# Altium schematic sheet MCU.SchDoc
size A3; SheetNumber: 2; SheetTotal: 3
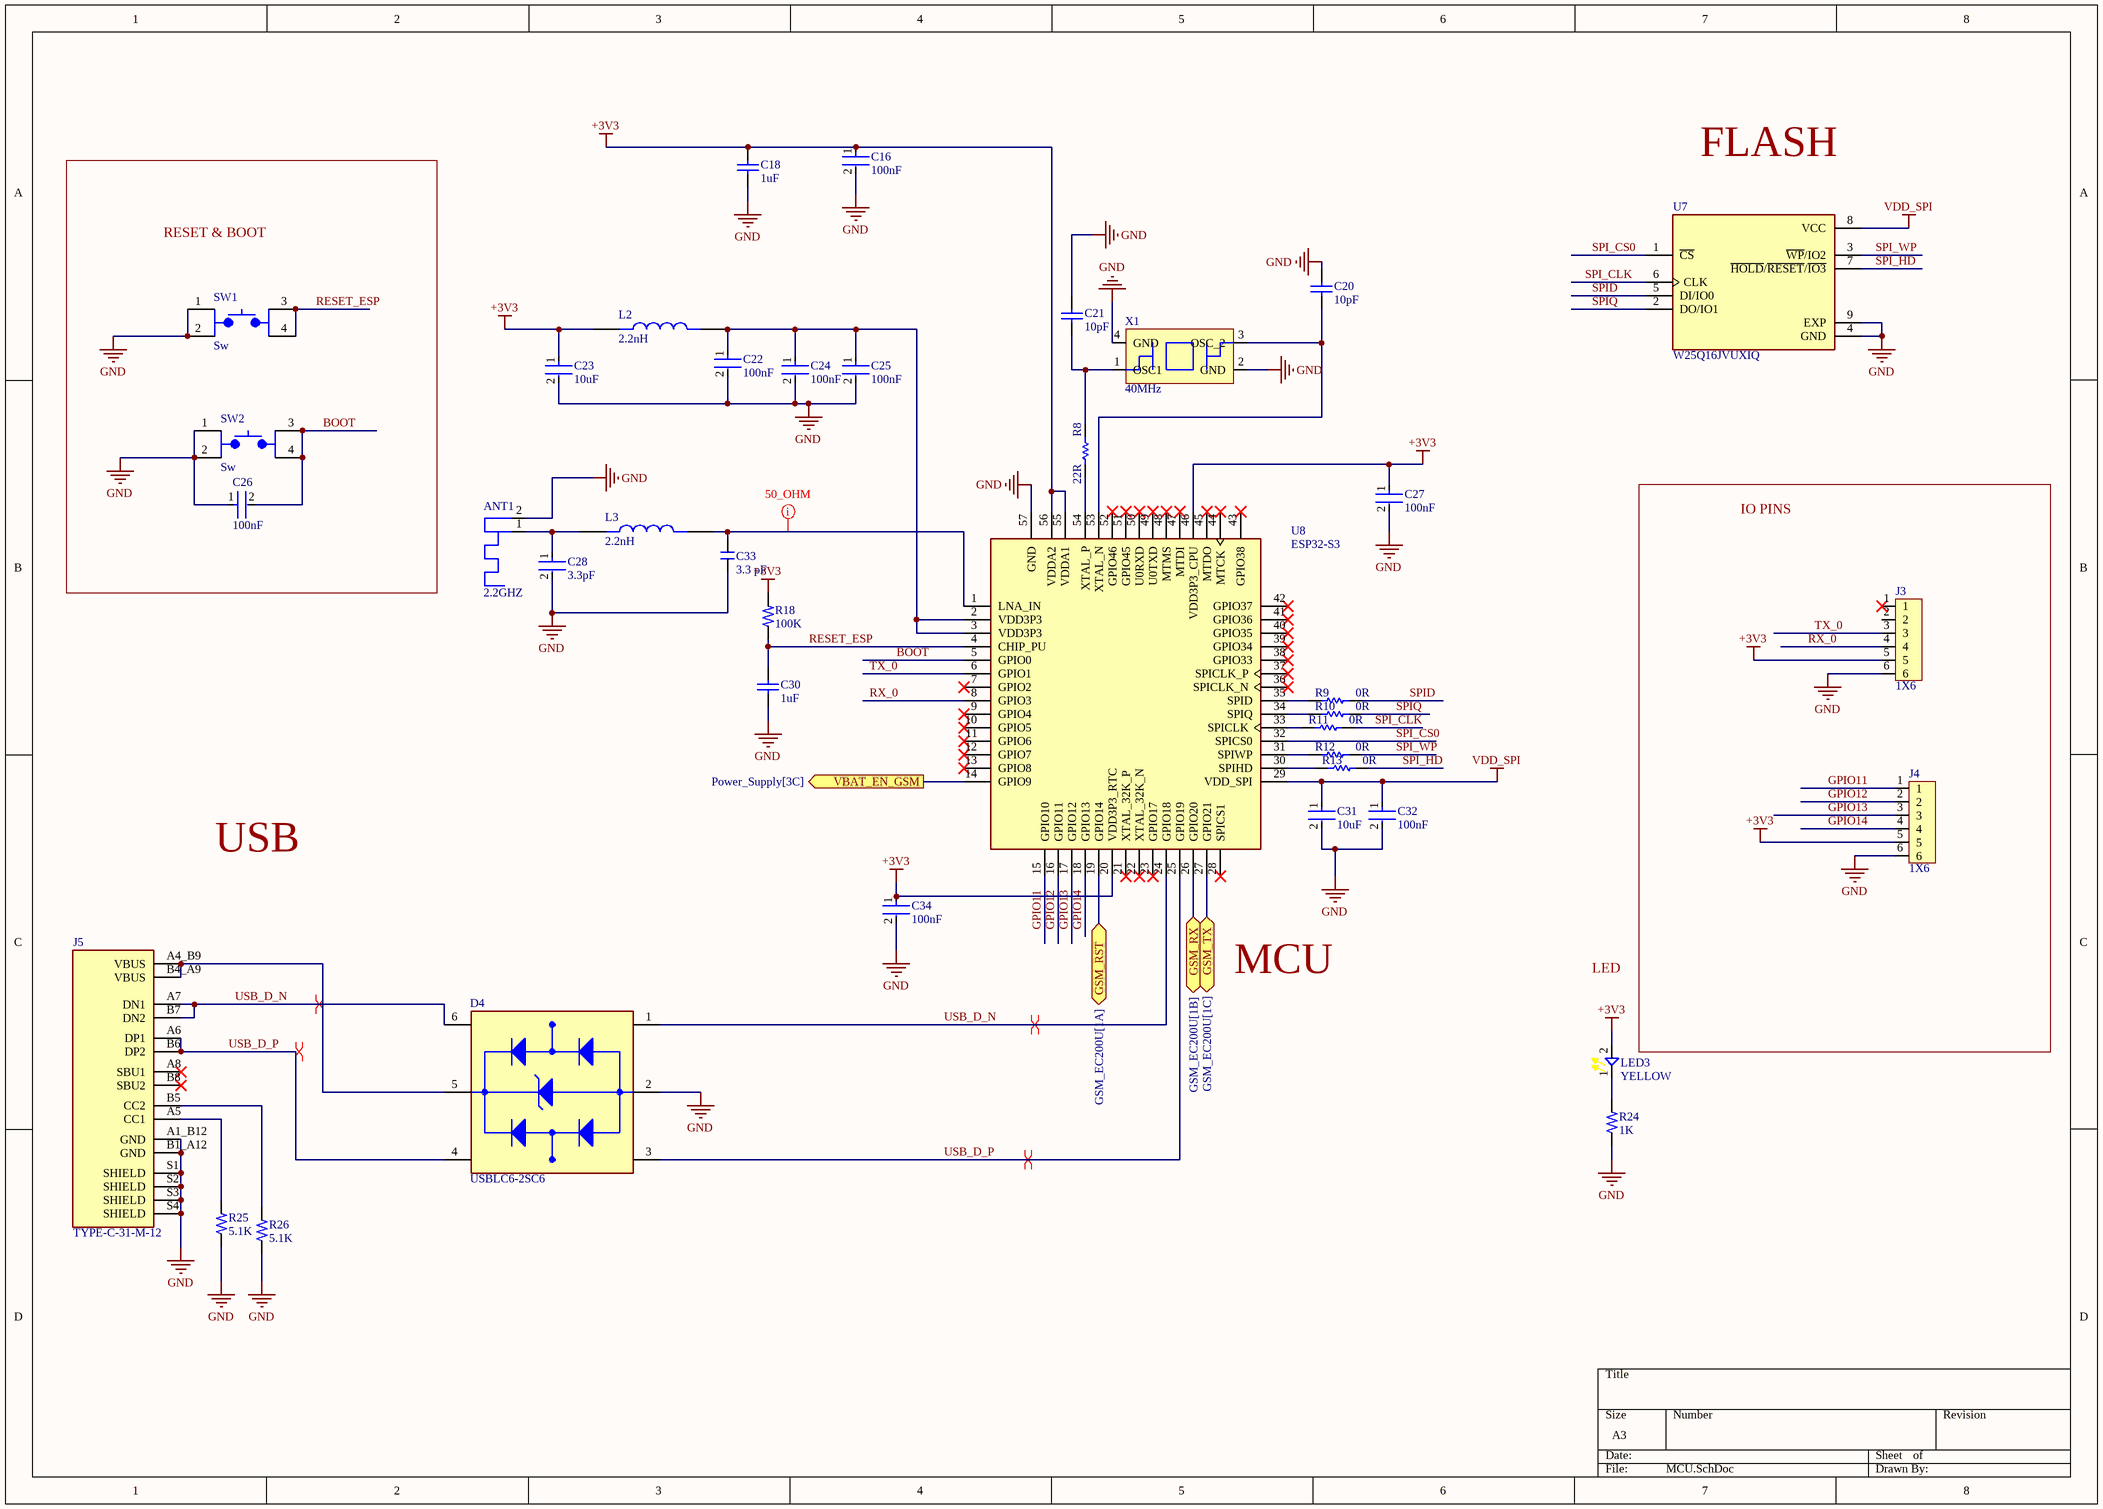
[diagram p0: MCU.SchDoc]

## Parts
ANT1  2.2GHZ  [2.4 GHz PCB antenna]
C16  100nF  [FP-CGA3E-0_3-0_1-IPC_A]
C18  1uF  [CAPC1608X90X35LL15T15]
C20  10pF  [CAPC1608X90X35LL10T15]
C21  10pF  [CAPC1608X90X35LL10T15]
C22  100nF  [FP-CGA3E-0_3-0_1-IPC_A]
C23  10uF  [FP-GRM188-0_1-e0_2_0_55-IPC_A]
C24  100nF  [FP-CGA3E-0_3-0_1-IPC_A]
C25  100nF  [FP-CGA3E-0_3-0_1-IPC_A]
C26  100nF  [FP-CGA3E-0_3-0_1-IPC_A]
C27  100nF  [FP-CGA3E-0_3-0_1-IPC_A]
C28  3.3pF  [FP-C0603C-CF-MFG]
C30  1uF  [CAPC1608X90X35LL15T15]
C31  10uF  [FP-GRM188-0_1-e0_2_0_55-IPC_A]
C32  100nF  [FP-CGA3E-0_3-0_1-IPC_A]
C33  3.3 pF  [Capacitor_0805]
C34  100nF  [FP-CGA3E-0_3-0_1-IPC_A]
D4  USBLC6-2SC6  [SOT-23-6]
J3  1X6  [Header_1X6_2.54mm]
J4  1X6  [Header_1X6_2.54mm]
J5  TYPE-C-31-M-12  [TYPE-C-31-M-12]
L2  2.2nH  [Inductor_0603]
L3  2.2nH  [Inductor_0603]
LED3  YELLOW  [LED_YELLOW_0603]
R8  22R  [RESC1608X55X25NL10T15]
R9  0R  [RESC1609X50X30NL8T20]
R10  0R  [RESC1609X50X30NL8T20]
R11  0R  [RESC1609X50X30NL8T20]
R12  0R  [RESC1609X50X30NL8T20]
R13  0R  [RESC1609X50X30NL8T20]
R18  100K  [Resistor_0603]
R24  1K  [Resistor_0805]
R25  5.1K  [Resistor_0805]
R26  5.1K  [Resistor_0805]
SW1  Sw  [SW_Tactile_SMD]
SW2  Sw  [SW_Tactile_SMD]
U7  W25Q16JVUXIQ  [8_USON]
U8  ESP32-S3  [ESP32S3]
X1  40MHz  [SMD2520-4P]

## Blocks framed on the sheet
RESET & BOOT: C26 SW1 SW2
IO PINS: J3 J4

## Ports
GSM_RST (bidir, see GSM_EC200U[1A]), GSM_RX (bidir, see GSM_EC200U[1B]), GSM_TX (bidir, see GSM_EC200U[1C]), VBAT_EN_GSM (out, see Power_Supply[3C])

## Nets
+3V3: C16.1 C18.2 C23.1 C27.1 C34.1 J3.5 J4.5 L2.1 LED3.2 R18.2 U8.20(VDD3P3_RTC) U8.46(VDD3P3_CPU) U8.55(VDDA1) U8.56(VDDA2)
GND: ANT1.2 C16.2 C18.1 C20.2 C21.2 C22.2 C23.2 C24.2 C25.2 C26.1 C27.2 C28.2 C30.1 C31.2 C32.2 C33.1 C34.2 D4.2(GND) J3.6 J4.6 J5.A1_B12(GND) J5.B1_A12(GND) J5.S1(SHIELD) J5.S2(SHIELD) J5.S3(SHIELD) J5.S4(SHIELD) R24.1 R25.1 R26.1 SW1.1 SW1.2 SW2.1 SW2.2 U7.4(GND) U7.9(EXP) U8.57(GND) X1.2(GND) X1.4(GND)
VDD_SPI: C31.1 C32.1 U7.8(VCC) U8.29(VDD_SPI)
BOOT: C26.2 SW2.3 SW2.4 U8.5(GPIO0)
GPIO11: J4.1 U8.15(GPIO10)
GPIO12: J4.2 U8.16(GPIO11)
GPIO13: J4.3 U8.17(GPIO12)
GPIO14: J4.4 U8.18(GPIO13)
GSM_RST: U8.19(GPIO14) ; port GSM_RST
GSM_RX: U8.26(GPIO20) ; port GSM_RX
GSM_TX: U8.27(GPIO21) ; port GSM_TX
RESET_ESP: C30.2 R18.1 SW1.3 SW1.4 U8.4(CHIP_PU)
RX_0: J3.4 U8.8(GPIO3)
SPI_CLK: R11.2 U7.6(CLK)
SPI_CS0: U7.1(~{CS}) U8.32(SPICS0)
SPI_HD: R13.2 U7.7(~{HOLD}/~{RESET}/~{IO3})
SPI_WP: R12.2 U7.3(~{WP}/IO2)
SPID: R9.2 U7.5(DI/IO0)
SPIQ: R10.2 U7.2(DO/IO1)
TX_0: J3.3 U8.6(GPIO1)
USB_D_N: D4.1(I/O1_IN) D4.6(I/O1_OUT) J5.A7(DN1) J5.B7(DN2) U8.24(GPIO18)
USB_D_P: D4.3(I/O2_IN) D4.4(I/O2_OUT) J5.A6(DP1) J5.B6(DP2) U8.25(GPIO19)
VBAT_EN_GSM: U8.14(GPIO9) ; port VBAT_EN_GSM
NetANT1_1: ANT1.1 C28.1 L3.1
NetC20_1: C20.1 U8.53(XTAL_N) X1.3(OSC_2)
NetC21_1: C21.1 R8.2 X1.1(OSC1)
NetC22_1: C22.1 C24.1 C25.1 L2.2 U8.2(VDD3P3) U8.3(VDD3P3)
NetC33_2: C33.2 L3.2 U8.1(LNA_IN)
NetD4_5: D4.5(VBUS) J5.A4_B9(VBUS) J5.B4_A9(VBUS)
NetJ5_A5: J5.A5(CC1) R25.2
NetJ5_B5: J5.B5(CC2) R26.2
NetLED3_1: LED3.1 R24.2
NetR8_1: R8.1 U8.54(XTAL_P)
NetR9_1: R9.1 U8.35(SPID)
NetR10_1: R10.1 U8.34(SPIQ)
NetR11_1: R11.1 U8.33(SPICLK)
NetR12_1: R12.1 U8.31(SPIWP)
NetR13_1: R13.1 U8.30(SPIHD)

Not connected (* = marked no-connect by the designer): J3 1* 2; J5 A8(SBU1)* B8(SBU2)*; U8 7(GPIO2)* 9(GPIO4)* 10(GPIO5)* 11(GPIO6)* 12(GPIO7)* 13(GPIO8)* 21(XTAL_32K_P)* 22(XTAL_32K_N)* 23(GPIO17)* 28(SPICS1)* 36(SPICLK_N)* 37(SPICLK_P)* 38(GPIO33)* 39(GPIO34)* 40(GPIO35)* 41(GPIO36)* 42(GPIO37)* 43(GPIO38)* 44(MTCK)* 45(MTDO)* 47(MTDI)* 48(MTMS)* 49(U0TXD)* 50(U0RXD)* 51(GPIO45)* 52(GPIO46)*

## Layout directives
differential pair; net class 90_OHM: USB_D_N, USB_D_P
net class 50_OHM: NetC33_2

## Notes on the sheet
- FLASH
- USB
- MCU
- LED

## Library data of the parts
ANT1 = 2.4 GHz PCB antenna
C16 C22 C24-C27 C32 C34 = CMP-2000-07546-2: Cap Ceramic 100nF 50V X7R 10% Pad SMD 0603 +125°C Automotive T/R; Weight: 7.1E-05oz; Composition: Ceramic; Max Operating Temperature: 125°C; Termination: SMD/SMT; Dielectric: X7R; Length: 1.6mm; Package Quantity: 1; REACH SVHC: No SVHC; Lead Free: Lead Free; Case Code (Metric): 1608; Min Operating Temperature: -55°C; Packaging: Tape and Reel; Tolerance: 10%; Voltage Rating: 50V; Case Code (Imperial): 0603; Capacitance: 100nF; Case/Package: 0603; Voltage Rating (DC): 50V; Depth: 0.8mm; Radiation Hardening: No; Ratings: AEC-Q200; Mount: Surface Mount; Voltage: 50V; Thickness: 0.035inch; Width: 0.8mm; Height: 0.8mm
C18 C30 = CMP-2006-02298-2: Manufacturer: Kemet; Part Number: C0603C105K4RACTU
C20 C21 = CMP-2006-02592-1: Part Number: GRM1885C1H100JA01D; Manufacturer: Murata
C23 C31 = CMP-2006-02792-2: Chip Multilayer Ceramic Capacitors for General Purpose, 0603, 10uF, X5R, 15%, 20%, 6.3V; Packaging: Tape and Reel; Voltage Rating (DC): 6.3V; Width: 0.031inch; Termination: SMD/SMT; Dielectric: X5R; Package Quantity: 4000; Voltage Rating: 6.3V; Capacitance: 10uF; Case/Package: 0603; Min Operating Temperature: -55°C; Voltage: 6.3V; Length: 1.6mm; Thickness: 0.035inch; Lead Free: Lead Free; Depth: 0.8mm; Case Code (Imperial): 0603; Max Operating Temperature: 85°C; Material: Ceramic; Height: 0.8mm; Tolerance: 20%; Mount: Surface Mount; REACH SVHC: No SVHC; Radiation Hardening: No; Case Code (Metric): 1608
C28 = CMP-1035-00238-3: CAP CER 3.3PF 50V NP0 0603; Manufacturer Part Number: C0603C339C5GACTU; Manufacturer: KEMET; Tolerance: 0.25 pF; Material: Ceramic; Temperature Characteristic: C0G; Automotive Grade: Grade 1; Temperature Coefficient: 30ppm/°C; Height: 0.87mm; Category: Cap; Automotive: Yes; Voltage Rating: 50 V; Capacitance: 3.3 pF; ComponentLink2Description: Datasheet; Octopart: https://octopart.com/c0603c339c5gactu-kemet-3701205; Temperature Range Low: -55°C; Device Class L3: Ceramic Capacitors; Package: C0603C-CF; Temperature: -55°C to +125°C; Digikey Description: CAP CER 3.3PF 50V NP0 0603; Temperature Range High: +125°C; ComponentLink2URL: https://api.kemet.com/component-edge/download/datasheet/C0603C100J5GACAUTO.pdf; Device Class L1: Passive Components; Value: 3.3 pF; RoHS: TRUE; Lead Free: Yes; Mouser Description: Multilayer Ceramic Capacitors MLCC - SMD/SMT 50volts 3.3pF C0G 0.25%; Device Class L2: Capacitors
C33 = CAP 3.3 pF 0805: Multilayer Ceramic Capacitor, 3.3 pF, 50 V, ± 0.1pF, C0G (NP0), 0805 [2012 Metric]; Manufacturer: Yageo; Manufacturer Part Number: CC0805BRNPO9BN3R3; Supplier: Digikey; Supplier Part Number: 311-4130-1-ND; RoHS: Yes; Category: Ceramic Capacitors; Stock: 19725; Pricing: 1=0,13, 10=0,075, 100=0,0453, 1000=0,03028 (USD); Halogen Free: 5694HalogenFree; ComponentLink1URL: http://www.mouser.com/ds/2/447/Yageo_UPY-GP_NP0_16V-to-50V_9-358835.pdf?src-supplier=Mouser; ComponentLink1Description: http://www.mouser.com/ds/2/447/Yageo_UPY-GP_NP0_16V-to-50V_9-358835.pdf?src-supplier=Mouser; ComponentLink2URL: https://datasheet.octopart.com/CC0805BRNPO9BN3R3-Yageo-datasheet-151948684.pdf?src-supplier=Newark; ComponentLink2Description: https://datasheet.octopart.com/CC0805BRNPO9BN3R3-Yageo-datasheet-151948684.pdf?src-supplier=Newark; ComponentLink3URL: https://datasheet.octopart.com/CC0805BRNPO9BN3R3-Yageo-datasheet-151948684.pdf?src-supplier=Farnell; ComponentLink3Description: https://datasheet.octopart.com/CC0805BRNPO9BN3R3-Yageo-datasheet-151948684.pdf?src-supplier=Farnell; ComponentLink4URL: http://www.yageo.com/documents/recent/UPY-GP_NP0_16V-to-50V_8.pdf?src-supplier=Avnet; ComponentLink4Description: http://www.yageo.com/documents/recent/UPY-GP_NP0_16V-to-50V_8.pdf?src-supplier=Avnet; ComponentLink5URL: https://www.yageo.com/upload/media/product/productsearch/datasheet/mlcc/UPY-GP_NP0_16V-to-50V_18.pdf?src-supplier=Digikey; ComponentLink5Description: https://www.yageo.com/upload/media/product/productsearch/datasheet/mlcc/UPY-GP_NP0_16V-to-50V_18.pdf?src-supplier=Digikey; ComponentLink6URL: http://www.yageo.com/exep/pages/download/literatures/ProductSelectionGuide%202014_Final_2.pdf?src-supplier=Digikey; ComponentLink6Description: http://www.yageo.com/exep/pages/download/literatures/ProductSelectionGuide%202014_Final_2.pdf?src-supplier=Digikey; ComponentLink7URL: http://www.yageo.com/documents/recent/UPY-GP_NP0_16V-to-50V_9.pdf?src-supplier=Future+Electronics; ComponentLink7Description: http://www.yageo.com/documents/recent/UPY-GP_NP0_16V-to-50V_9.pdf?src-supplier=Future+Electronics; ComponentLink8URL: https://datasheet.octopart.com/CC0805BRNPO9BN3R3-Yageo-datasheet-137700082.pdf?src-supplier=Future+Electronics; ComponentLink8Description: https://datasheet.octopart.com/CC0805BRNPO9BN3R3-Yageo-datasheet-137700082.pdf?src-supplier=Future+Electronics
D4 = USBLC6-2SC6: ESD Suppressor Diode Array Dual Uni-Dir 15kV Air Gap/15kV Contact Disc 6-Pin SOT-23 T/R; Manufacturer: STMicroelectronics; Direction: Unidirectional,Bidirectional; Value: 3.5pF; Operating Supply Voltage: 1.1V; Number of Channels: 2; Breakdown Voltage: 6V; Clamping Voltage: 17V; Reverse Standoff Voltage: 5.25V; Power Line Protection: Yes; Test Current: 1mA; Max Reverse Leakage Current: 150nA; Peak Pulse Current: 5A; Data Rate: 480Mbps; Number of Elements: 1; Working Voltage: 5V; Supplier: Arrow Electronics; Supplier Part Number: USBLC6-2SC6; Manufacturer Part Number: USBLC6-2SC6; RoHS: Yes; Category: TVS Diodes; Stock: 222000; Pricing: 3000=0,0796, 6000=0,0796, 9000=0,0796 (USD); Mounting Technology: Surface Mount; Case/Package: SOT-23; Pins: 6; Min Operating Temperature: -40°C; Max Operating Temperature: 125°C; Packaging: Tape and Reel; Package Quantity: 3000; Termination: SMD/SMT; Number of Bidirectional Channels: 2; Min Breakdown Voltage: 6V; ESD Protection: Yes; Leakage Current: 150nA; Series: USB; Reverse Breakdown Voltage: 6V; Polarity: Unidirectional,Bidirectional; Max Breakdown Voltage: 6V; Clamping Voltage-Max: 17V; Max Repetitive Reverse Voltage (Vrrm): 5.25V; Length: 3.05mm; Width: 1.75mm; Height: 1.3mm; Depth: 1.75mm; Radiation Hardening: No; Lead Free: Lead Free; Reach SVHC Compliant: No; RoHS Compliant: Yes; ComponentLink1URL: https://datasheet.ciiva.com/1268/1690354-1268384.pdf?src-supplier=Element14; ComponentLink1Description: https://datasheet.ciiva.com/1268/1690354-1268384.pdf?src-supplier=Element14; ComponentLink2URL: https://datasheet.ciiva.com/4508/cd00050750-113117-4508433.pdf?src-supplier=Mouser; ComponentLink2Description: https://datasheet.ciiva.com/4508/cd00050750-113117-4508433.pdf?src-supplier=Mouser; ComponentLink3URL: https://datasheet.ciiva.com/15143/getdatasheetpartid-148465-15143789.pdf?src-supplier=Verical; ComponentLink3Description: https://datasheet.ciiva.com/15143/getdatasheetpartid-148465-15143789.pdf?src-supplier=Verical; ComponentLink4URL: https://datasheet.ciiva.com/16200/cd00050750-16200026.pdf?src-supplier=Future+Electronics; ComponentLink4Description: https://datasheet.ciiva.com/16200/cd00050750-16200026.pdf?src-supplier=Future+Electronics; ComponentLink5URL: https://datasheet.ciiva.com/41444/001184109-da-01-en-ic-esd-protecti-usblc6-2sc6-sot-23-6-stm-41444156.pdf?src-supplier=Conrad; ComponentLink5Description: https://datasheet.ciiva.com/41444/001184109-da-01-en-ic-esd-protecti-usblc6-2sc6-sot-23-6-stm-41444156.pdf?src-supplier=Conrad
J3 J4 = Header Male 1X6: THT Vertical Pin Header WR-PHD, Pitch 2.54 mm, Single Row, 6 pins; Manufacturer: Wurth Electronics; Manufacturer Part Number: 61300611121; Current Rating: 3A; Voltage Rating: 250V; Number of Positions: 6; Gender: 29Gender; Contact Resistance: 20mR; Pitch: 0.1inch; Supplier: Mouser; Supplier Part Number: 710-61300611121; RoHS: Yes; Category: Headers and Wire Housings; Stock: 8481; Pricing: 1=0,35, 10=0,298, 50=0,207, 100=0,187, 1000=0,171, 10000=0,17 (USD); Mounting Technology: Through Hole; Contact Plating: Gold; Contact Material: Copper Alloy,Copper; Housing Material: PBT; Color: Black; Min Operating Temperature: -40°C; Max Operating Temperature: 125°C; Number of Rows: 1; Contact Gender: Male; Packaging: Bulk; Termination: Through Hole; Number of Contacts: 6; Series: WR-PHD; Contact Type: Male Pin; Operating Supply Voltage: 250V; Orientation: 5495OrientationType; Height: 8.89mm; Contact Mating Length: 0.236inch; RoHS Compliant: Yes; Reach SVHC Compliant: Unknown; Lead Free: 5697LeadFree; ComponentLink1URL: http://www.mouser.com/ds/2/445/6130xx11121-538006.pdf?src-supplier=Mouser; ComponentLink1Description: http://www.mouser.com/ds/2/445/6130xx11121-538006.pdf?src-supplier=Mouser; ComponentLink2URL: http://www.farnell.com/cad/1737268.pdf?src-supplier=Element14; ComponentLink2Description: http://www.farnell.com/cad/1737268.pdf?src-supplier=Element14; ComponentLink3URL: https://datasheet.octopart.com/61300611121-W%C3%BCrth-Elektronik-datasheet-21154836.pdf?src-supplier=Element14; ComponentLink3Description: https://datasheet.octopart.com/61300611121-W%C3%BCrth-Elektronik-datasheet-21154836.pdf?src-supplier=Element14; ComponentLink4URL: https://katalog.we-online.de/em/datasheet/6130xx11121.pdf?src-supplier=Digikey; ComponentLink4Description: https://katalog.we-online.de/em/datasheet/6130xx11121.pdf?src-supplier=Digikey
J5 = TYPE-C-31-M-12: Manufacturer: HRO Electronics; Supplier: LCSC; Supplier Part Number: C165948; Manufacturer Part Number: TYPE-C-31-M-12; RoHS: No; Category: LDO; Stock: 137245; Pricing: 5=0,171, 50=0,1346, 150=0,1168, 1000=0,0966, 2000=0,0923, 5000=0,0896 (USD)
L2 L3 = Inductor 2.2nH 0603: 2nH 0603 Inductors (SMD) ROHS; Manufacturer: FH (Guangdong Fenghua Advanced Tech); Manufacturer Part Number: VHF160808H2N0ST
LED3 = LED_Yellow_0603: TJ-S1608SW6TGLCCW-A5; Manufacturer: Togialed; Supplier: LCSC; Supplier Part Number: C192669; Manufacturer Part Number: TJ-S1608SW6TGLCCW-A5; RoHS: No; Stock: 15460; Pricing: 10=0,0384, 100=0,0311, 300=0,0275, 1000=0,0248, 4000=0,0209, 8000=0,0198 (USD)
R8 = CMP-1659-00033-1: Chip Resistor, 22 Ohm, +/- 1%, 0.1 W, -55 to 155 degC, 0603 (1608 Metric), RoHS, Tape and Reel; Max Ouput Current: 8 A; Case\Package: SIP; Max Input Voltage: 1.4 V; ComponentLink2URL: http://www.yageo.com/documents/recent/PYu-RC_Group_51_RoHS_L_04.pdf; RoHSCompliant: true; Max Operating Temperature: 100 degC; PackageDescription: 2-Pin Surface Mount Device, Body 1.6 x 0.8 mm; ComponentLink1Description: Manufacturer URL; ComponentLink1URL: http://www.yageo.com/; Length: 18.5 mm; REACH SVHC: Unknown; Pins: 4; DatasheetVersion: Rev. 4, 02/2016; PackageReference: 0603; Output Current: 8 A; Min Operating Temperature: -25 degC; Height: 19.6 mm; Mount: Through Hole; Radiation Hardening: No; ComponentLink2Description: Datasheet; Package Quantity: 200; Packaging: Rail/Tube
R9-R13 = CMP-2000-03816-5: Chip Resistor, 0 Ohm, Jumper, 100 mW, -55 to 155 degC, 0603 (1608 Metric), RoHS, Tape and Reel; Manufacturer: Vishay Semiconductor; Voltage Rating: 75 V; Package Quantity: 5000; DatasheetVersion: 06/2012; Min Operating Temperature: -55 degC; ComponentLink1URL: http://www.vishay.com/; Mounting Technology: Surface Mount; Height: 0.45 mm; ComponentLink1Description: Manufacturer URL; REACH SVHC: Unknown; PackageReference: 0603; Packaging: Tape and Reel; Max Operating Temperature: 155 degC; Mount: Surface Mount; ComponentLink2Description: Datasheet; PackageDescription: 2-Pin Surface Mount Device, Body 1.575 x 0.85 mm; Length: 1.55 mm; ComponentLink2URL: http://www.vishay.com/docs/20035/dcrcwe3.pdf; Pins: 2; RoHSCompliant: true
R18 = R_100K_0603: Res Thick Film 0603 100K Ohm 1% 0.1W(1/10W) ±100ppm/C Pad SMD Automotive T/R; Manufacturer: Stackpole Electronics; Manufacturer Part Number: RMCF0603FT100K; Value: 100kR; Max Power Dissipation: 100mW; Temperature Coefficient: 100ppm/°C; Voltage Rating: 75V; Supplier: Digikey; Supplier Part Number: RMCF0603FT100KCT-ND; RoHS: Yes; Category: Chip SMD Resistors; Stock: 722640; Pricing: 1=0,1, 10=0,02, 100=0,0091, 1000=0,0048, 2500=0,00386 (USD); Mounting Technology: Surface Mount; Case/Package: 0603; Case Code (Metric): 1608; Case Code (Imperial): 0603; Contact Plating: Tin,Matte; Min Operating Temperature: -55°C; Max Operating Temperature: 155°C; Tolerance: 1%; Packaging: Tape and Reel; Number of Terminations: 2; Features: Automotive AEC-Q200; Series: RMCF; Construction: Rectangular; Length: 1.55mm; Width: 0.031inch; Height: 0.022inch; Depth: 0.8mm; Radiation Hardening: No; Military Standard: Not; RoHS Compliant: Yes; Lead Free: 5697LeadFree; ComponentLink1URL: https://datasheet.ciiva.com/15193/getdatasheetpartid-362597-15193437.pdf?src-supplier=Verical; ComponentLink1Description: https://datasheet.ciiva.com/15193/getdatasheetpartid-362597-15193437.pdf?src-supplier=Verical
R24 = Res 1K 0805: 125Mw Thick Film Resistors 100Ppm/ 1% 1K 0805 Chip Resistor Surface Mount Rohs; Manufacturer: Yageo; Manufacturer Part Number: RC0805FR-071KL; Value: 1kR; Voltage Rating (DC): 150V; Temperature Coefficient: 100ppm/°C; Supplier: Avnet; Supplier Part Number: 82K7536; RoHS: Yes; Category: Chip SMD Resistors; Stock: 255910; Pricing: 10=0,014, 25=0,012, 50=0,01, 100=0,009 (USD); Case/Package: 0805; Pins: 2; Case Code (Metric): 2012; Case Code (Imperial): 0805; Min Operating Temperature: -55°C; Max Operating Temperature: 155°C; Tolerance: 1%; Packaging: Tape and Reel; Resistor Type: Thick Film; Package Quantity: 1; Voltage Rating: 150V; Termination: SMD/SMT; Series: RC; Power Rating: 125mW; Number of Terminations: 2; Max Power Dissipation: 125mW; Features: Moisture Resistant; Resistance Tolerance: 1%; Construction: Rectangular; Voltage Rating (AC): 150V; Length: 0.079inch; Width: 0.049inch; Height: 0.024inch; Depth: 1.25mm; Reach SVHC Compliant: No; Lead Free: Lead Free; RoHS Compliant: Yes; Military Standard: Not; ComponentLink1URL: https://datasheet.ciiva.com/7941/1686128-7941719.pdf?src-supplier=Element14; ComponentLink1Description: https://datasheet.ciiva.com/7941/1686128-7941719.pdf?src-supplier=Element14; ComponentLink2URL: https://datasheet.ciiva.com/46385/444164-46385020.pdf?src-supplier=Element14; ComponentLink2Description: https://datasheet.ciiva.com/46385/444164-46385020.pdf?src-supplier=Element14; ComponentLink3URL: https://datasheet.ciiva.com/2456/pyu-r-int-thick-7-2456976.pdf?src-supplier=Digikey; ComponentLink3Description: https://datasheet.ciiva.com/2456/pyu-r-int-thick-7-2456976.pdf?src-supplier=Digikey; ComponentLink4URL: https://datasheet.ciiva.com/2456/pyu-r-int-thick-7-2456977.pdf?src-supplier=Digikey; ComponentLink4Description: https://datasheet.ciiva.com/2456/pyu-r-int-thick-7-2456977.pdf?src-supplier=Digikey; ComponentLink5URL: https://datasheet.ciiva.com/2456/pyu-r-int-thick-7-2456975.pdf?src-supplier=Digikey; ComponentLink5Description: https://datasheet.ciiva.com/2456/pyu-r-int-thick-7-2456975.pdf?src-supplier=Digikey; ComponentLink6URL: https://datasheet.ciiva.com/16850/rc0805-16850409.pdf?src-supplier=Future+Electronics; ComponentLink6Description: https://datasheet.ciiva.com/16850/rc0805-16850409.pdf?src-supplier=Future+Electronics
R25 R26 = RES 5.1K 0805: Res Thin Film 0805 5.1K Ohm 0.1% 1/8W ±10ppm/°C Molded SMD Paper T/R; Manufacturer: Yageo; Manufacturer Part Number: RT0805BRD075K1L; Value: 5.1kR; Power Rating: 125mW; Voltage Rating: 150V; Temperature Coefficient: 25ppm/°C; Supplier: Digikey; Supplier Part Number: YAG1938CT-ND; RoHS: Yes; Category: Chip SMD Resistors; Stock: 24867; Pricing: 1=0,14, 10=0,099, 50=0,0918, 100=0,0826, 500=0,06324, 1000=0,05712 (USD); Case/Package: 0805; Case Code (Metric): 2012; Case Code (Imperial): 0805; Weight: 0.000194oz; Min Operating Temperature: -55°C; Max Operating Temperature: 155°C; Package Quantity: 5000; Packaging: Tape and Reel; Number of Terminations: 2; Termination: SMD/SMT; Max Power Dissipation: 125mW; Voltage Rating (DC): 150V; Features: Moisture Resistant; Series: RT; Length: 0.079inch; Width: 1.25mm; Height: 0.024inch; Lead Free: Lead Free; RoHS Compliant: Yes; ComponentLink1URL: https://datasheet.ciiva.com/12810/pyu-rt-1-to-0-05-rohs-l-4-12810709.pdf?src-supplier=Mouser; ComponentLink1Description: https://datasheet.ciiva.com/12810/pyu-rt-1-to-0-05-rohs-l-4-12810709.pdf?src-supplier=Mouser; ComponentLink2URL: https://datasheet.ciiva.com/2585/pyu-rt-1-to-0-05-rohs-l-4-2585107.pdf?src-supplier=Digikey; ComponentLink2Description: https://datasheet.ciiva.com/2585/pyu-rt-1-to-0-05-rohs-l-4-2585107.pdf?src-supplier=Digikey; ComponentLink3URL: https://datasheet.ciiva.com/46635/pyu-rt-1-to-0-05-rohs-l-5-46635340.pdf?src-supplier=Digikey; ComponentLink3Description: https://datasheet.ciiva.com/46635/pyu-rt-1-to-0-05-rohs-l-5-46635340.pdf?src-supplier=Digikey
SW1 SW2 = SW_Tactile_SPST: TL3305A Series SPST 12 V 4.5 x 4.5 mm 260 gf Top Actuated SMT Tactile Switch; Manufacturer: E-Switch; Manufacturer Part Number: TL3305AF260QG; Mechanical Life: 200000Cycles; Illumination Type: Non-Illuminated; Operating Force: 260gf; Switch Travel: 0.2mm; Switch Function: Off-Mom; Actuator Type: Standard; Supplier: Digikey; Supplier Part Number: EG5353CT-ND; RoHS: No; Category: Tactile Switches; Stock: 97166; Pricing: 1=0,2, 10=0,176, 25=0,1664, 100=0,153, 250=0,14456, 500=0,1385, 1000=0,13264 (USD); Mounting Technology: Surface Mount; Min Operating Temperature: -20°C; Max Operating Temperature: 70°C; Packaging: Cut Tape; Termination: Gull Wing; Throw Configuration: SPST; Series: TL3305; Lead Free: Lead Free; ComponentLink1URL: http://www.farnell.com/datasheets/2554191.pdf?src-supplier=Farnell; ComponentLink1Description: http://www.farnell.com/datasheets/2554191.pdf?src-supplier=Farnell; ComponentLink2URL: http://www.farnell.com/datasheets/2554191.pdf?src-supplier=Newark; ComponentLink2Description: http://www.farnell.com/datasheets/2554191.pdf?src-supplier=Newark; ComponentLink3URL: http://spec_sheets.e-switch.com/specs/P010471.pdf?src-supplier=Mouser; ComponentLink3Description: http://spec_sheets.e-switch.com/specs/P010471.pdf?src-supplier=Mouser; ComponentLink4URL: http://www.farnell.com/datasheets/2554191.pdf?src-supplier=Element14; ComponentLink4Description: http://www.farnell.com/datasheets/2554191.pdf?src-supplier=Element14; ComponentLink5URL: http://spec_sheets.e-switch.com/specs/P010471.pdf?src-supplier=Digikey; ComponentLink5Description: http://spec_sheets.e-switch.com/specs/P010471.pdf?src-supplier=Digikey; ComponentLink6URL: http://spec_sheets.e-switch.com/specs/P010471.pdf?src-supplier=NAC+Semi; ComponentLink6Description: http://spec_sheets.e-switch.com/specs/P010471.pdf?src-supplier=NAC+Semi
U7 = W25Q16JVUXIQ TR: NOR Flash Serial (SPI, Dual SPI, Quad SPI) 3V/3.3V 16M-bit 2M x 8 6ns 8-Pin USON EP T/R; Manufacturer: Winbond; Supplier: Digikey; Supplier Part Number: 256-W25Q16JVUXIQTRCT-ND; Manufacturer Part Number: W25Q16JVUXIQ TR; RoHS: No; Category: Memory; Stock: 6291; Pricing: 1=0,51, 10=0,477, 25=0,464, 50=0,4542, 100=0,4444, 250=0,43128, 500=0,4213, 1000=0,41135 (USD)
U8 = ESP32-S3R8: RF System on a Chip - SoC SMD IC, Dual-Core MCU, Wi-Fi 2.4G BLE 5.0 Combo; Manufacturer: Espressif Systems; Supplier: Digikey; Supplier Part Number: 1904-ESP32-S3R8DKR-ND; Manufacturer Part Number: ESP32-S3R8; RoHS: No; Category: RF Receivers, Transceivers; Pricing: 1=2,51 (USD); ComponentLink1URL: https://datasheet.octopart.com/ESP32-S3R8-Espressif-Systems-datasheet-165560561.pdf?src-supplier=TME; ComponentLink1Description: https://datasheet.octopart.com/ESP32-S3R8-Espressif-Systems-datasheet-165560561.pdf?src-supplier=TME
X1 = Q24FA20H0020900: Manufacturer: Seiko; Supplier: LCSC; Supplier Part Number: C255973; Manufacturer Part Number: Q24FA20H0020900; RoHS: No